# Altium schematic sheet 6 clock.SchDoc
size A4; SheetNumber: 9; SheetTotal: 13
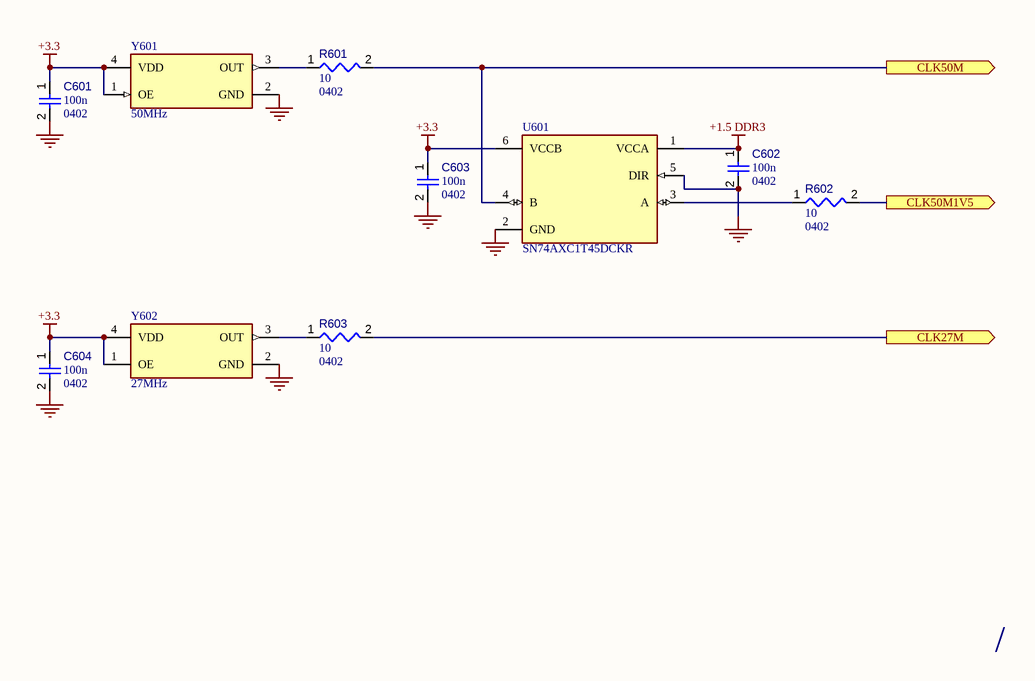
[diagram p0: 6 clock.SchDoc]

## Parts
C601  value 100n  Case/Package: 0402  [CAPC0402(1005)60_L]  (hidden comment: Capacitors,0402,100n,16)
C602  value 100n  Case/Package: 0402  [CAPC0402(1005)60_L]  (hidden comment: Capacitors,0402,100n,16)
C603  value 100n  Case/Package: 0402  [CAPC0402(1005)60_L]  (hidden comment: Capacitors,0402,100n,16)
C604  value 100n  Case/Package: 0402  [CAPC0402(1005)60_L]  (hidden comment: Capacitors,0402,100n,16)
R601  value 10  Case/Package: 0402  [RESC0402(1005)_L]  (hidden comment: Resistors,0402,10)
R602  value 10  Case/Package: 0402  [RESC0402(1005)_L]  (hidden comment: Resistors,0402,10)
R603  value 10  Case/Package: 0402  [RESC0402(1005)_L]  (hidden comment: Resistors,0402,10)
U601  SN74AXC1T45DCKR  [FP-DCK0006A-MFG]
Y601  Frequency: 50MHz  [FP-SiT8008-2-MFG]  (hidden comment: SIT8008BI-23-33E-50.000000E)
Y602  Frequency: 27MHz  [FP-SiT8208-2-MFG]  (hidden comment: SIT8208AI-2F-33E-27.000000Y)

## Ports
CLK27M (out), CLK50M1V5 (out), CLK50M (out)

## Nets
+1.5 DDR3: C602.1 U601.1(VCCA)
+3.3: C601.1 C603.1 C604.1 U601.6(VCCB) Y601.1(OE) Y601.4(VDD) Y602.1(OE) Y602.4(VDD)
GND: C601.2 C602.2 C603.2 C604.2 U601.2(GND) U601.5(DIR) Y601.2(GND) Y602.2(GND)
CLK27M: R603.2 ; port CLK27M
CLK50M: R601.2 U601.4(B) ; port CLK50M
CLK50M1V5: R602.2 ; port CLK50M1V5
NetR601_1: R601.1 Y601.3(OUT)
NetR602_1: R602.1 U601.3(A)
NetR603_1: R603.1 Y602.3(OUT)

## Notes on the sheet
- /

## Library data of the parts
C601-C604 = Capacitors: Capacitor; Voltage Rating: 16; Component Type: Capacitors
R601-R603 = Resistors: Resistor; Component Type: Resistors
U601 = CMP-04899-000070-1: IC TRNSLTR BIDIRECTIONAL SC70-6; Number of Bits: 1; Data Rate: 500Mbps; Channel Type: Bidirectional; Packaging: Tape and Reel; Number of Circuits: 1; Mount: Surface Mount; RoHS Compliant: Yes; Max Operating Temperature: 125°C; Min Operating Temperature: -40°C
Y601 = CMP-25159-264756-1: 50 MHz XO (Standard) HCMOS, LVCMOS Oscillator 3.3V Enable/Disable 4-SMD, No Lead; Max Supply Current: 4.5mA; Frequency Stability: 50ppm; Packaging: Tape and Reel; Max Operating Temperature: 85°C; Case/Package: SMD/SMT; Mount: Surface Mount; RoHS Compliant: Yes; Min Operating Temperature: -40°C; Series: SIT8008B
Y602 = CMP-25159-260479-1: MEMS OSC XO 27.0000MHZ LVCMOS LV; RoHS Compliant: Yes; Series: *